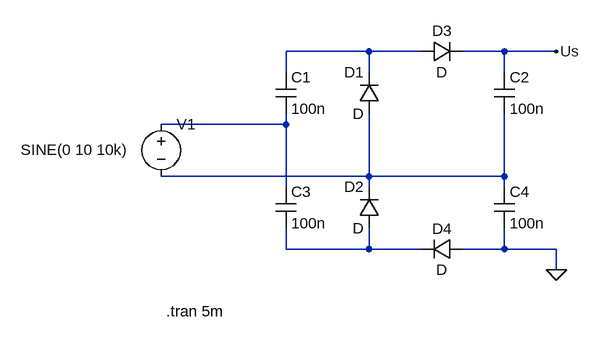
[diagram p0: schematic multiplicateur_tension_x5_10OnF (circuit de Greinacher).asc]
multiplicateur_tension_x5_10OnF (circuit de Greinacher).asc, the LTspice schematic file:
Version 4
SHEET 1 880 680
WIRE 416 192 288 192
WIRE 496 192 416 192
WIRE 624 192 560 192
WIRE 704 192 624 192
WIRE 288 224 288 192
WIRE 416 224 416 192
WIRE 624 224 624 192
WIRE 288 304 288 288
WIRE 288 304 96 304
WIRE 416 384 416 288
WIRE 416 384 96 384
WIRE 624 384 624 288
WIRE 624 384 416 384
WIRE 288 400 288 304
WIRE 416 400 416 384
WIRE 624 400 624 384
WIRE 288 496 288 464
WIRE 416 496 416 464
WIRE 416 496 288 496
WIRE 496 496 416 496
WIRE 624 496 624 464
WIRE 624 496 560 496
WIRE 704 496 624 496
WIRE 704 528 704 496
FLAG 704 192 Us
FLAG 704 528 0
SYMBOL voltage 96 288 R0
WINDOW 3 -216 55 Left 2
SYMATTR InstName V1
SYMATTR Value SINE(0 10 10k)
SYMBOL cap 272 224 R0
SYMATTR InstName C1
SYMATTR Value 100n
SYMBOL cap 608 224 R0
SYMATTR InstName C2
SYMATTR Value 100n
SYMBOL cap 272 400 R0
SYMATTR InstName C3
SYMATTR Value 100n
SYMBOL cap 608 400 R0
SYMATTR InstName C4
SYMATTR Value 100n
SYMBOL diode 432 288 R180
WINDOW 0 24 64 Left 2
WINDOW 3 24 0 Left 2
SYMATTR InstName D1
SYMBOL diode 432 464 R180
WINDOW 0 24 64 Left 2
WINDOW 3 24 0 Left 2
SYMATTR InstName D2
SYMBOL diode 496 208 R270
WINDOW 0 32 32 VTop 2
WINDOW 3 0 32 VBottom 2
SYMATTR InstName D3
SYMBOL diode 560 480 R90
WINDOW 0 0 32 VBottom 2
WINDOW 3 32 32 VTop 2
SYMATTR InstName D4
TEXT 104 592 Left 2 !.tran 5m

The netlist it stands for:
* multiplicateur_tension_x5_10OnF (circuit de Greinacher).asc
V1 N002 N003 SINE(0 10 10k)
C1 N001 N002 100n
C2 Us N003 100n
C3 N002 N004 100n
C4 N003 0 100n
D1 N003 N001 D
D2 N004 N003 D
D3 N001 Us D
D4 0 N004 D
.model D D
.lib standard.dio
.tran 5m
.backanno
.end